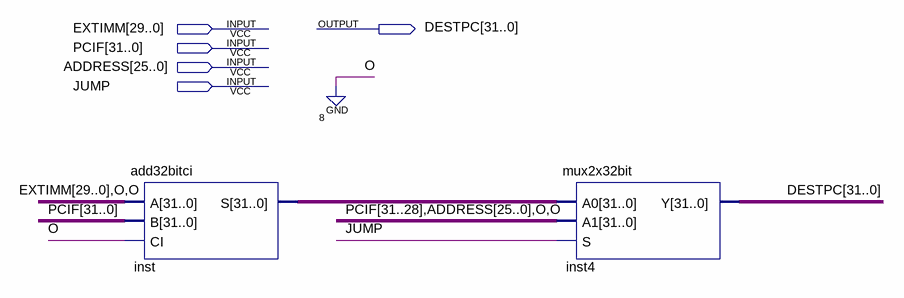
[diagram p0: schematic sheet]
// Quartus schematic PCDecision.bdf as structural Verilog: 2 symbols, 5 pins
module PCDecision (
  input  [29:0] EXTIMM,
  input  [31:0] PCIF,
  input  [25:0] ADDRESS,
  input  JUMP,
  output [31:0] DESTPC
);

  wire [31:0] inst_s;

  add32bitci inst (.A({EXTIMM, 2'b00}), .B(PCIF), .CI(1'b0), .S(inst_s));
  mux2x32bit inst4 (.A0(inst_s), .A1({PCIF[31:28], ADDRESS, 2'b00}), .S(JUMP), .Y(DESTPC));
endmodule
